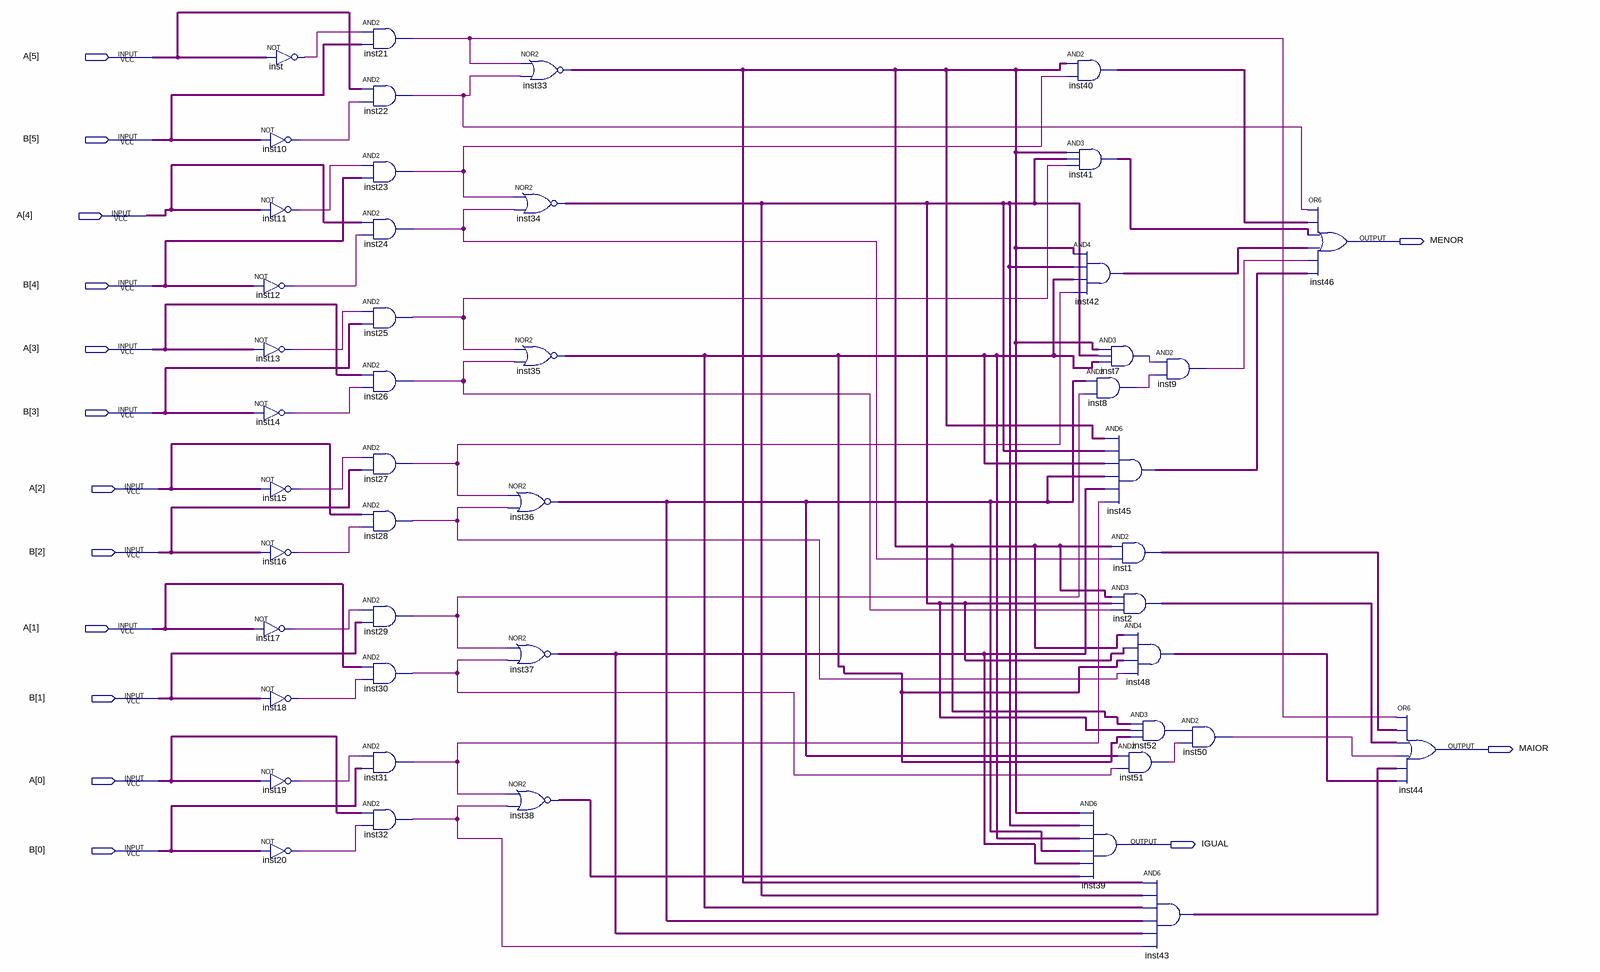
[diagram p0: schematic sheet]
// Quartus schematic Comparador.bdf as structural Verilog: 47 symbols, 15 pins
module Comparador (
  input  [5:0] A,
  input  [5:0] B,
  output MENOR,
  output MAIOR,
  output IGUAL
);

  wire inst1_out, inst2_out, inst7_out, inst8_out, inst9_out, inst10_out, inst11_out, inst12_out, inst13_out,
       inst14_out, inst15_out, inst16_out, inst17_out, inst18_out, inst19_out, inst20_out, inst21_out,
       inst22_out, inst23_out, inst24_out, inst25_out, inst26_out, inst27_out, inst28_out, inst29_out,
       inst30_out, inst31_out, inst32_out, inst33_out, inst34_out, inst35_out, inst36_out, inst37_out,
       inst38_out, inst40_out, inst41_out, inst42_out, inst43_out, inst45_out, inst48_out, inst50_out,
       inst51_out, inst52_out, inst_out;

  not inst (inst_out, A[5]);
  not inst10 (inst10_out, B[5]);
  not inst11 (inst11_out, A[4]);
  not inst12 (inst12_out, B[4]);
  not inst13 (inst13_out, A[3]);
  not inst14 (inst14_out, B[3]);
  not inst15 (inst15_out, A[2]);
  not inst16 (inst16_out, B[2]);
  not inst17 (inst17_out, A[1]);
  not inst18 (inst18_out, B[1]);
  not inst19 (inst19_out, A[0]);
  not inst20 (inst20_out, B[0]);
  and inst21 (inst21_out, inst_out, B[5]);
  and inst22 (inst22_out, A[5], inst10_out);
  and inst23 (inst23_out, inst11_out, B[4]);
  and inst24 (inst24_out, A[4], inst12_out);
  and inst25 (inst25_out, inst13_out, B[3]);
  and inst26 (inst26_out, A[3], inst14_out);
  and inst27 (inst27_out, inst15_out, B[2]);
  and inst28 (inst28_out, A[2], inst16_out);
  and inst29 (inst29_out, inst17_out, B[1]);
  and inst30 (inst30_out, A[1], inst18_out);
  and inst31 (inst31_out, inst19_out, B[0]);
  and inst32 (inst32_out, A[0], inst20_out);
  nor inst33 (inst33_out, inst21_out, inst22_out);
  nor inst34 (inst34_out, inst23_out, inst24_out);
  nor inst35 (inst35_out, inst25_out, inst26_out);
  nor inst36 (inst36_out, inst27_out, inst28_out);
  nor inst37 (inst37_out, inst29_out, inst30_out);
  nor inst38 (inst38_out, inst31_out, inst32_out);
  and inst40 (inst40_out, inst33_out, inst23_out);
  and inst41 (inst41_out, inst33_out, inst34_out, inst25_out);
  and inst42 (inst42_out, inst33_out, inst34_out, inst35_out, inst27_out);
  and inst7 (inst7_out, inst33_out, inst34_out, inst35_out);
  and inst8 (inst8_out, inst36_out, inst29_out);
  and inst45 (inst45_out, inst33_out, inst34_out, inst35_out, inst36_out, inst37_out, inst31_out);
  and inst1 (inst1_out, inst33_out, inst24_out);
  and inst2 (inst2_out, inst33_out, inst34_out, inst26_out);
  and inst39 (IGUAL, inst33_out, inst34_out, inst35_out, inst36_out, inst37_out, inst38_out);
  and inst9 (inst9_out, inst7_out, inst8_out);
  and inst48 (inst48_out, inst33_out, inst34_out, inst35_out, inst28_out);
  and inst52 (inst52_out, inst33_out, inst34_out, inst35_out);
  and inst51 (inst51_out, inst36_out, inst30_out);
  and inst43 (inst43_out, inst33_out, inst34_out, inst35_out, inst36_out, inst37_out, inst32_out);
  and inst50 (inst50_out, inst52_out, inst51_out);
  or inst46 (MENOR, inst22_out, inst40_out, inst41_out, inst42_out, inst9_out, inst45_out);
  or inst44 (MAIOR, inst21_out, inst1_out, inst2_out, inst50_out, inst43_out, inst48_out);
endmodule
